# EAGLE design design1 (EAGLE 7.3.0)
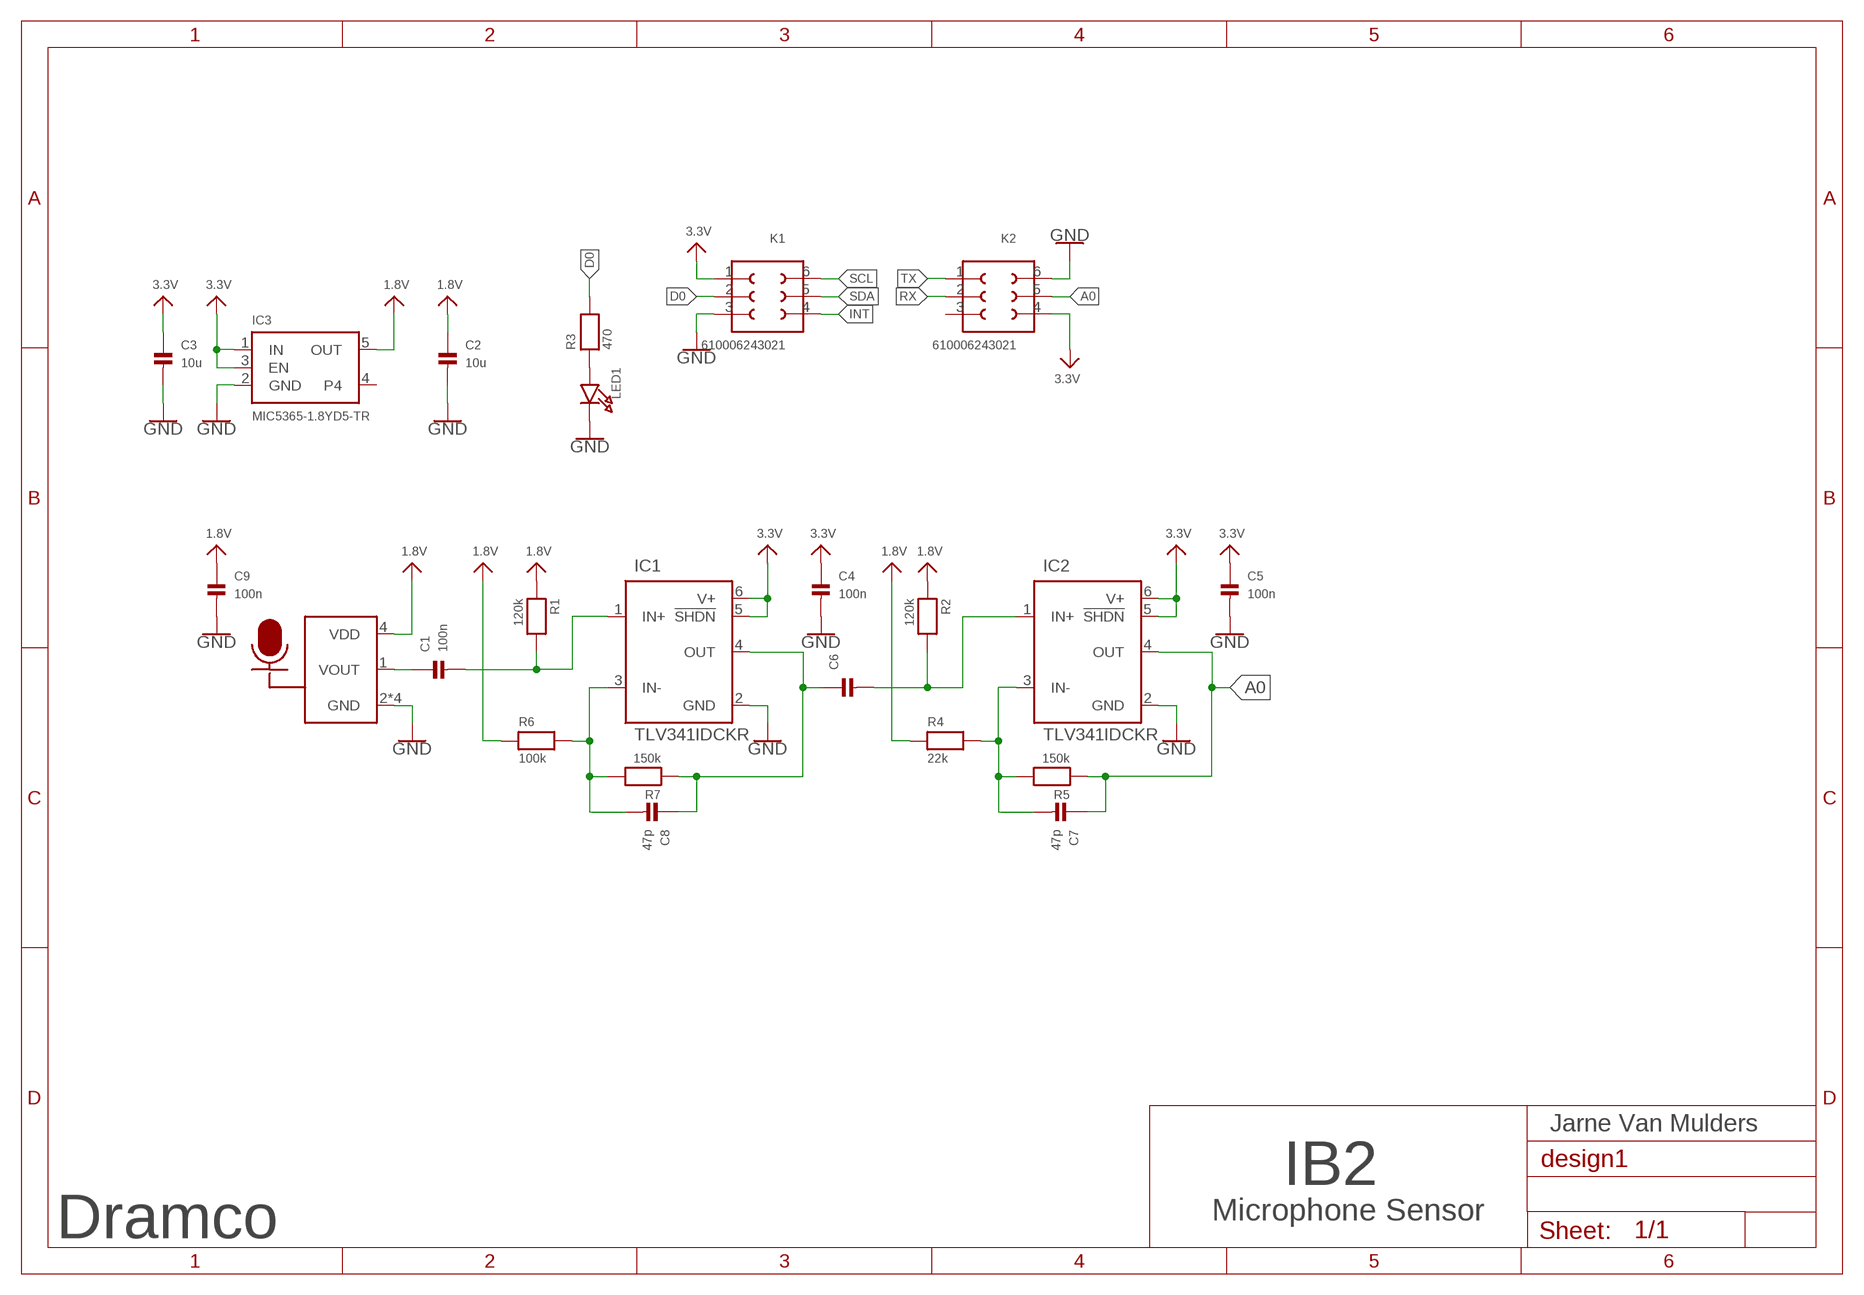
[diagram p0: schematic, sheet 1]

## Parts
C1  100n  CAP_CERAMIC0603MINI  [0603-MINI]
C2  10u  CAP_CERAMIC0603MINI  [0603-MINI]
C3  10u  CAP_CERAMIC0603MINI  [0603-MINI]
C4  100n  CAP_CERAMIC0603MINI  [0603-MINI]
C5  100n  CAP_CERAMIC0603MINI  [0603-MINI]
C6  CAP_CERAMIC0603MINI  [0603-MINI]
C7  47p  CAP_CERAMIC0603MINI  [0603-MINI]
C8  47p  CAP_CERAMIC0603MINI  [0603-MINI]
C9  100n  CAP_CERAMIC0603MINI  [0603-MINI]
IC1  TLV341IDCKR  [SOT65P210X110-6N]
IC2  TLV341IDCKR  [SOT65P210X110-6N]
IC3  MIC5365-1.8YD5-TR  VREG_SOT23-5  [SOT23-5]
IC4  VM1000  [VM1000]
K1  610006243021  [610006243021]
K2  610006243021  [610006243021]
LED1  LED0805  [CHIPLED_0805]
R1  120k  RESISTOR0603MINI  [0603-MINI]
R2  120k  RESISTOR0603MINI  [0603-MINI]
R3  470  RESISTOR0603MINI  [0603-MINI]
R4  22k  RESISTOR0603MINI  [0603-MINI]
R5  150k  RESISTOR0603MINI  [0603-MINI]
R6  100k  RESISTOR0603MINI  [0603-MINI]
R7  150k  RESISTOR0603MINI  [0603-MINI]

## Nets
1.8V: C2.1 C9.1 IC3.5(OUT) IC4.4(VDD) R1.1 R2.1 R4.1 R6.1
3.3V: C3.1 C4.1 C5.1 IC1.5(!SHDN!) IC1.6(V+) IC2.5(!SHDN!) IC2.6(V+) IC3.1(IN) IC3.3(EN) K1.1 K2.4
A0: C7.1 IC2.4(OUT) K2.5 R5.1
D0: K1.2 R3.2
GND: C2.2 C3.2 C4.2 C5.2 C9.2 IC1.2(GND) IC2.2(GND) IC3.2(GND) IC4.2(GND) IC4.3(GND) IC4.5(GND) IC4.6(GND) K1.3 K2.6 LED1.C
INT: K1.4
N$1: C1.1 IC4.1(VOUT)
N$2: C1.2 IC1.1(IN+) R1.2
N$3: LED1.A R3.1
N$4: C7.2 IC2.3(IN-) R4.2 R5.2
N$5: C6.1 C8.1 IC1.4(OUT) R7.1
N$6: C6.2 IC2.1(IN+) R2.2
N$7: C8.2 IC1.3(IN-) R6.2 R7.2
RX: K2.2
SCL: K1.6
SDA: K1.5
TX: K2.1
Unconnected: IC3.4 K2.3

## Notes on the sheet
- Jarne Van Mulders
- IB2
- Microphone Sensor
- Dramco

## Library data of the parts
C1-C9 = microbuilder:CAP_CERAMIC: Ceramic Capacitors 0402 - 0402 Surface Mount Capacitors 16pF 50V 5% [Digikey: 445-4899-2-ND] 18pF 50V 5% [Digikey: 490-1281-2-ND] 22pF 50V 5% [Digikey: 490-1283-2-ND] 68pF 50V 5% [Digikey: 490-1289-2-ND] 0.1uF 10V 10% [Digikey: 490-1318-2-ND] 1.0uF 6.3V 10% [Digikey: 490-1320-2-ND] 0603 - 0603 Surface Mount Capacitors 16 pF 50V 5% [Digikey: 445-5051-2-ND] 22 pF 50V [Digikey: PCC220ACVTR-ND] 33 pF 50V 5% [Digikey: 490-1415-1-ND] 56pF 50V 5% [Digikey: 490-1421-1-ND] 220pF 50V 5% [Digikey: 445-1285-1-ND] 680 pF 50V 2200 pF 50V 5% C0G [Digikey: 445-1297-1-ND] 5600 pF 100V 5% X7R [Digikey: 478-3711-1-ND] 0.1 µF 25V 10% [Digikey: PCC2277TR-ND] 0.22 µF 16V 10% X7R [Digikey: 445-1318-1-ND] 1.0 µF 25V 10% [Digikey: 445-5146-2-ND] 0603 - RF Specific 3pF 250V +/-0.1pF RF [Digikey: 712-1347-1-ND] 18 pF 250V 5% [Digikey: 478-3505-1-ND or 712-1322-1-ND] 56 pF 250V 5% C0G RF [Digikey: 490-4867-1-ND] 68 pF 250V RF [Digikey: 490-4868-1-ND] 0805 - 0805 Surface Mount Capacitors 220 pF 250V 2% RF Ceramic Capacitor [Digikey: 712-1398-1-ND] 1000 pF 50V 2% NP0 Ceramic Capacitor [Digikey: 478-3760-1-ND] 0.1 µF 25V 10% Ceramic Capacitor [Digikey: PCC1828TR-ND] 1.0 µF 16V 10% Ceramic Capacitor[Digikey: 490-1691-2-ND] 10.0 µF 10V 10% Ceramic Capacitor[Digikey: 709-1228-1-ND] 10.0 uF 16V 10% Ceramic Capacitor [Digikey: 478-5165-2-ND] 47 uF 6.3V 20% Ceramic Capacitor [Digikey: 587-1779-1-ND or 399-5506-1-ND] 1206 - 1206 Surface Mount Capacitors 47uF 10V 20% Ceramic Capacitor [Digikey: 490-5528-1-ND or 399-5508-1-ND or 445-6010-1-ND] 100uF 6.3V -20%, +80% Y5V Ceramic Capacitor (Digikey: 490-4512-1-ND, Mouser: 81-GRM31CF50J107ZE1L)
IC1 IC2 = TLV341IDCKR:TLV341IDCKR
IC3 = microbuilder:VREG_SOT23-5: SOT23-5 Fixed Voltage Regulators To better organise some of the SOT23-5 fixed voltage regulators in this library, this new part was created. Part Current Out V Out V In V Dropout Digikey Part No. ADP121 150mA 3.3V 3.4-5.5V 0.09V @ 150mA ADP121-AUJZ33R7CT-ND ADP121 150mA 3.0V 3.1-5.5V 0.09V @ 150mA ADP121-AUJZ30R7CT-ND ADP122 300mA 3.3V 3.4-5.5V 0.085V @ 300mA ADP122AUJZ-3.3-R7CT-ND ADP1712 300mA 3.3V 3.5-5.5V 0.17V @ 300mA ADP1712AUJZ-3.3-R7TR-ND AP7311 (Low Cost) 150mA 3.3V 3.5-6V 0.15V @ 150mA AP7311-33WG-7DICT-ND LD39015M18R 150mA 1.8V 1.9V-5.5V 0.08V @ 100mA 497-6977-1-ND MCP1824T-3302E/OT 300mA 3.3V 3.5V-6V 0.2V @ 300mA MCP1824T-3302E/OTCT-ND MIC5205-2.5YM5 TR 150mA 2.5V 2.7-16V 0.165V @ 150mA 576-1257-2-ND MIC5205-3.0YM5 TR 150mA 3.0V 3.2V-16V 0.165V @ 150mA 576-1258-2-ND MIC5205-3.3YM5 TR 150mA 3.3V 3.5V-16V 0.165V @ 150mA 576-1259-2-ND TPS780330220 150mA 3.3V+2.2V 3.6-5.5V 250mV Max 296-23332-1-ND TDA3663/N1,135 100mA 3.3V 3.5-45V 0.18V @ 50mA 568-5343-1-ND
IC4 = VM1000:VM1000
K1 K2 = Wurth_Elektronik_Electromechanic_Board_to_Board_Connectors_rev15c:610006243021: WR-PHD 2.54mm SMT Dual Socket Header Bottom Entry, 6 Pins=>Code : Con_BTB_SHD_2.54_2_610006243021 <http://katalog.we-online.de/media/images/eican/Con_BTB_SHD_2.54_2_6100xx243021_pf2.jpg> Details see: http://katalog.we-online.de/en/em/610_0xx_243_021 Created 2014-05-30, Karrer Zheng 2014 (C) Würth Elektronik
LED1 = microbuilder:LED: LED 0603 - 0603 Surface Mount Package 2mA: Green LED - Low Power (3.9mcd, 2ma, 1.7Vf) - Digikey: 475-2709-2-ND Orange LED - Low Power (9.8mcd, 2ma, 1.8Vf) - Digikey: 475-1194-2-ND Red LED - Low Power (5mcd, 2ma, 1.8Vf) - Digikey: 475-1195-2-ND Yellow LED - Low Power (7mcd, 2ma, 1.8Vf) - Digikey: 475-1196-2-ND 5mA: Blue LED - Low Power (17mcd, 5ma, 2.9Vf) - Digikey: LNJ937W8CRACT-ND 0805 - 0805 Surface Mount Package 2mA: Red LED (8.8mcd, 2mA, 1.8Vf, Clear) - Low Power [Digikey: 475-2510-1-ND] Green LED (5mcd, 2mA, 1.8Vf, Clear) - Low Power [Digikey: 475-2730-1-ND] Yellow LED (11.3mcd, 2mA, 1.8Vf, Clear) - Low Power [Digikey: 475-2555-1-ND] 20mA: Red LED (104mcd, 20mA, Diffused) - LS R976 [Digikey: 475-1278-6-ND] Red LED (12mcd, 20mA, 2.0Vf, Clear) - APT2012EC [Digikey: 754-1128-1-ND] Green LED (15mcd, 20mA, 2.2Vf, Clear) - APT2012GC [Digikey: 754-1131-1-ND] Orange LED (160mcd, 20mA, 2.1Vf, Clear) - APT2012SECK [Digikey: 754-1130-1-ND] 1206 - 1206 Surface Mount Package Green LED (26mcd, 20mA, Diffused) - LG N971 [Digikey: 475-1407-6-ND] Red LED (15mcd, 20mA, Diffused) - LH N974 [Digikey: 475-1416-6-ND]
R1-R7 = microbuilder:RESISTOR: Resistors 0402 - 0402 Surface Mount Package 22 Ohm 1% 1/16W [Digikey: 311-22.0LRTR-ND] 33 Ohm 5% 1/16W 1.0K 5% 1/16W 1.5K 5% 1/16W 2.0K 1% 1/16W 10.0K 1% 1/16W [Digikey: 311-10.0KLRTR-ND] 10.0K 5% 1/16W [Digikey: RMCF0402JT10K0TR-ND] 12.1K 1% 1/16W [Digikey: 311-22.0LRTR-ND] 100.0K 5% 1/16W 0603 - 0603 Surface Mount Package 0 Ohm 1/10 Watt 1% Resistor 15 Ohm 1/10 Watt 1% Resistor 33 Ohm 1/10 Watt 1% Resistor 49.9 Ohm 1/10 Watt 1% Resistor 100 Ohm 1/10 Watt 1% Resistor 150 Ohm 1/10 Watt 1% Resistor 240 Ohm 1/10 Watt 1% Resistor 390 Ohm 1/10 Watt 1% Resistor 560 Ohm 1/10 Watt 1% Resistor 680 Ohm 1/10 Watt 1% Resistor 750 Ohm 1/10 Watt 1% Resistor 1.0K Ohm 1/10 Watt 1% Resistor 1.5K Ohm 1/10 Watt 1% Resistor 2.0K Ohm 1/10 Watt 1% Resistor 2.2K Ohm 1/10 Watt 1% Resistor 3.3K Ohm 1/10 Watt 1% Resistor 4.7K Ohm 1/10 Watt 1% Resistor 10.0K Ohm 1/10 Watt 1% Resistor 12.0K Ohm 1/10 Watt 1% Resistor 12.1K Ohm 1/10 Watt 1% Resistor 20.0K Ohm 1/10 Watt 1% Resistor 33.0K Ohm 1/10 Watt 1% Resistor 100.0K Ohm 1/10 Watt 1% Resistor 0805 - 0805 Surface Mount Package 0 Ohm 1/8 Watt 1% Resistor 33 Ohm 1/8 Watt 1% Resistor 100 Ohm 1/8 Watt 1% Resistor 150 Ohm 1/8 Watt 1% Resistor 200 Ohm 1/8 Watt 1% Resistor 240 Ohm 1/8 Watt 1% Resistor 330 Ohm 1/8 Watt 1% Resistor 390 Ohm 1/8 Watt 1% Resistor 470 Ohm 1/8 Watt 1% Resistor 1.0K Ohm 1/8 Watt 1% Resistor 1.5K Ohm 1/8 Watt 1% Resistor 2.0K Ohm 1/8 Watt 1% Resistor 4.7K Ohm 1/8 Watt 1% Resistor 5.1K Ohm 1/8 Watt 1% Resistor 5.6K Ohm 1/8 Watt 1% Resistor 10.0K Ohm 1/8 Watt 1% Resistor 22.0K Ohm 1/8 Watt 1% Resistor 33.0K Ohm 1/8 Watt 1% Resistor 100K Ohm 1/8 Watt 1% Resistor 1206 - 1206 Surface Mount Package 2012 - 2010 Surface Mount Package 0.11 Ohm 1/2 Watt 1% Resistor - Digikey: RHM.11UCT-ND

## Board
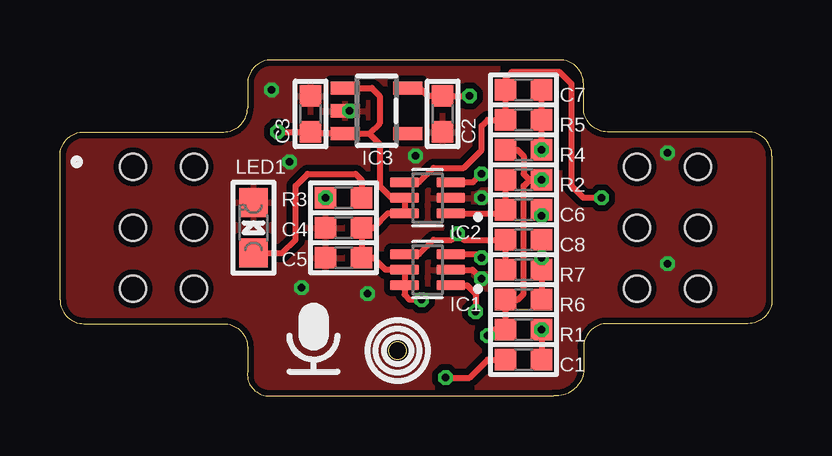
[diagram p1: board, top side]
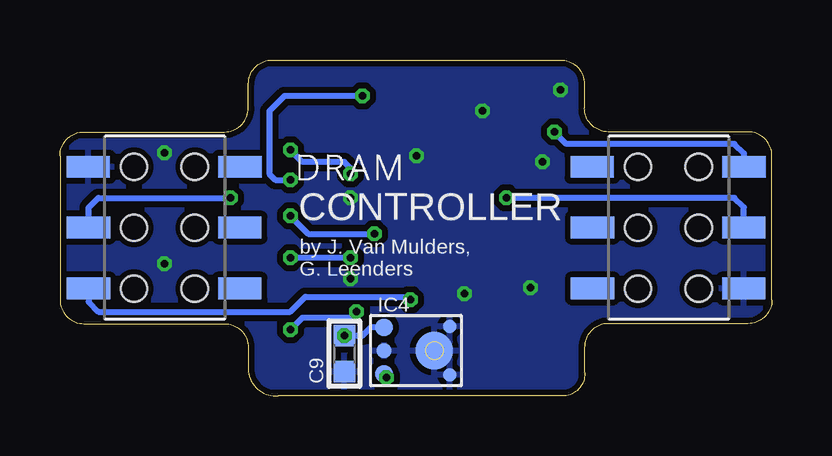
[diagram p2: board, bottom side, seen from below]

Size 29.67 x 14.01 mm. Coordinates in mm from the lower left corner, seen from the top.
Outline: 0,4.01 0,10.01 arc-90 1,11.01 6.81,11.01 arc90 7.81,12.01 7.81,13.01 arc-90 8.81,14.01 20.82,14.01 arc-90 21.82,13.01 21.82,12.01 arc90 22.82,11.01 28.67,11.01 arc-90 29.67,10.01 29.67,4.01 arc-90 28.67,3.01 22.82,3.01 arc90 21.82,2.01 21.82,1.01 arc-90 20.57,0.01 8.56,0.01 arc-90 7.81,1.01 7.81,2.01 arc90 6.81,3.01 1,3.01 arc-90 0,4.01
Copper layers (1*16): Top 0.035mm / dielectric 1.5mm / Bottom 0.035mm
Design rules "SeeedStudio_2layer_DRU_no_angle_20140221": minimum track width 6mil, minimum drill 12mil, track to track 6mil, track to pad 6mil, pad to pad 6mil, via to via 6mil, smd to smd 0mil, copper to edge 10mil, drill to drill 10mil, minimum pad ring 10mil, minimum via ring 6mil, stop-mask expansion 2mil, vias tented up to drill 100mil, thermal gap 10mil

### Footprints (pad centres in the part's own frame; a part is rotated, then mirrored left to right if it is on the bottom)
0603-MINI = smd 0.9 x 0.9: 1 -0.75,0; 2 0.75,0
SOT65P210X110-6N = smd 1.19 x 0.4: 1 -0.96,0.65; 2 -0.96,0; 3 -0.96,-0.65; 4 0.96,-0.65; 5 0.96,0; 6 0.96,0.65
SOT23-5 = smd 0.55 x 1.2: 1 -0.95,-1.3; 2 0,-1.3; 3 0.95,-1.3; 4 0.95,1.3; 5 -0.95,1.3
VM1000 = smd 0.723 x 0.723: 1 -2.1,-0.965; 4 -2.1,0.965 | smd 0.562 x 0.562: 2 0.64,-1.015; 3 0.64,1.015 | smd 0.612 x 0.612: 5 -2.1,0 | smd 1.56 x 1.56: 6 0,0
610006243021 = smd 0.9 x 1.8: 1 -2.54,3.15; 2 -0.01,3.14; 3 2.53,3.14; 4 2.53,-3.16; 5 -0.01,-3.16; 6 -2.54,-3.17 | hole 1.1: -2.54,1.27; 0,1.27; 0,-1.27; -2.54,-1.27; 2.54,1.27; 2.54,-1.27
CHIPLED_0805 = smd 1.2 x 1.2: A 0,-1.05; C 0,1.05

### Placement (x,y rotation side)
C1  19.32,1.51 0 top
C2  15.94,11.76 270 top
C3  10.44,11.76 90 top
C4  11.81,7.01 180 top
C5  11.81,5.76 180 top
C6  19.32,7.76 180 top
C7  19.32,12.76 0 top
C8  19.32,6.51 0 top
C9  17.82,1.76 270 bottom
IC1  15.31,5.26 180 top
IC2  15.31,8.26 180 top
IC3  13.19,11.88 270 top
IC4  14.06,1.88 0 bottom
K1  4.31,7.01 270 bottom
K2  25.32,7.01 270 bottom
LED1  8.06,7.01 0 top
R1  19.32,2.76 0 top
R2  19.32,9.01 180 top
R3  11.81,8.26 180 top
R4  19.32,10.26 0 top
R5  19.32,11.51 0 top
R6  19.32,4.01 0 top
R7  19.32,5.26 0 top

### Tracks (layer width: path | path; a pad name or v marks a point on that pad's centre or on a via)
1.8V  (via drill 0.31)
  Top 0.254: 19.57,9.01 19.32,8.76 19.32,4.26 19.07,4.01 R6.1 R1.1 18.07,2.76 C9.1 | 19.57,9.01 R2.1 | IC3.5 14.99,12.83 15.31,12.51 C2.1 v17.07,12.51 | R4.1 19.07,10.26 19.32,10.01 19.32,9.26 19.57,9.01
  Bottom 0.254: IC4.4 16.73,2.85 17.07,2.51 C9.1 | v17.07,12.51 20.32,12.51 20.94,11.88 20.94,9.26 20.69,9.01 R2.1
  other vias: 17.82,2.51 20.07,9.01
3.3V  (via drill 0.31)
  Top 0.254: v9.06,11.01 C3.1 10.51,10.93 IC3.3 12.89,10.93 | 12.89,10.93 13.31,10.51 13.31,8.76 13.81,8.26 IC2.5 IC2.6 13.66,7.61 13.06,7.01 C4.1 C5.1 13.06,5.76 13.56,5.26 IC1.5 IC1.6 14.35,4.22 14.56,4.01 v15.06,4.01 | IC3.1 12.99,12.83 13.31,12.51 13.31,11.36 12.89,10.93
  Bottom 0.254: K1.1 1.17,10.11 1.56,10.51 8.56,10.51 v9.06,11.01 | K2.4 28.48,3.92 28.07,3.51 20.07,3.51 19.44,4.13 15.19,4.13 v15.06,4.01
A0  (via drill 0.31)
  Top 0.254: IC2.4 14.96,8.91 15.56,9.51 16.82,9.51 17.57,10.26 17.57,11.26 17.82,11.51 R5.1 C7.1 18.57,13.26 18.82,13.51 20.82,13.51 21.32,13.01 21.32,8.76 21.82,8.26 v22.57,8.26
  Bottom 0.254: K2.5 28.48,7.85 28.07,8.26 v22.57,8.26
D0  (via drill 0.31)
  Bottom 0.254: K1.2 1.18,7.87 1.56,8.26 R3.2
  other vias: 11.06,8.26
GND  (via drill 0.31)
  Top 0.254: IC1.2 17.19,5.26 v17.57,4.88
  other vias: 25.32,5.51 12.81,4.26 10.06,4.51 9.56,9.76 8.81,12.76 17.57,8.26 14.81,10.01 12.06,11.88 25.32,10.13
  pour Bottom (isolate 0.254): -4.19,17.01 33.56,17.01 33.56,-3.74 -4.19,-3.74
  pour Top (isolate 0.254): -4.44,18.76 36.06,18.76 36.06,-4.74 -3.94,-4.74 arc-90 -4.44,-4.24
N$1  (via drill 0.31)
  Top 0.254: v16.07,0.76 17.07,0.76 17.82,1.51 C1.1
  Bottom 0.254: IC4.1 v16.07,0.76
N$2  (via drill 0.31)
  Top 0.254: R1.2 C1.2 | IC1.1 16.96,4.61 17.32,4.26 v17.32,3.51
  Bottom 0.254: v17.32,3.51 17.57,3.26 19.57,3.26 R1.2
  other vias: 20.07,2.76
N$3
  Top 0.254: LED1.A 9.26,5.96 9.81,6.51 9.81,8.76 10.31,9.26 12.31,9.26 12.56,9.01 R3.1
N$4  (via drill 0.31)
  Top 0.254: IC2.3 17.21,8.91 v17.57,9.26 | R4.2 R5.2 C7.2
  Bottom 0.254: v17.57,9.26 17.57,9.51 17.82,9.76 19.57,9.76 R4.2
  other vias: 20.07,10.26
N$5  (via drill 0.31)
  Top 0.254: R7.1 C8.1 16.82,6.51 v16.57,6.76 16.32,6.51 15.56,6.51 14.96,5.91 IC1.4 | C6.1 v20.07,7.51
  Bottom 0.254: v20.07,7.51 19.32,6.76 v16.57,6.76
N$6
  Top 0.254: IC2.1 18.42,7.61 C6.2 R2.2
N$7  (via drill 0.31)
  Top 0.254: C8.2 v20.07,5.76 R7.2 R6.2 | IC1.3 17.42,5.91 v17.57,5.76
  Bottom 0.254: v17.57,5.76 v20.07,5.76

### Text on the board
bPlace: CONTROLLER | by J. Van Mulders, / G. Leenders